# EAGLE design MainModule (EAGLE 6.6.0)

## Sheet 1 of 2
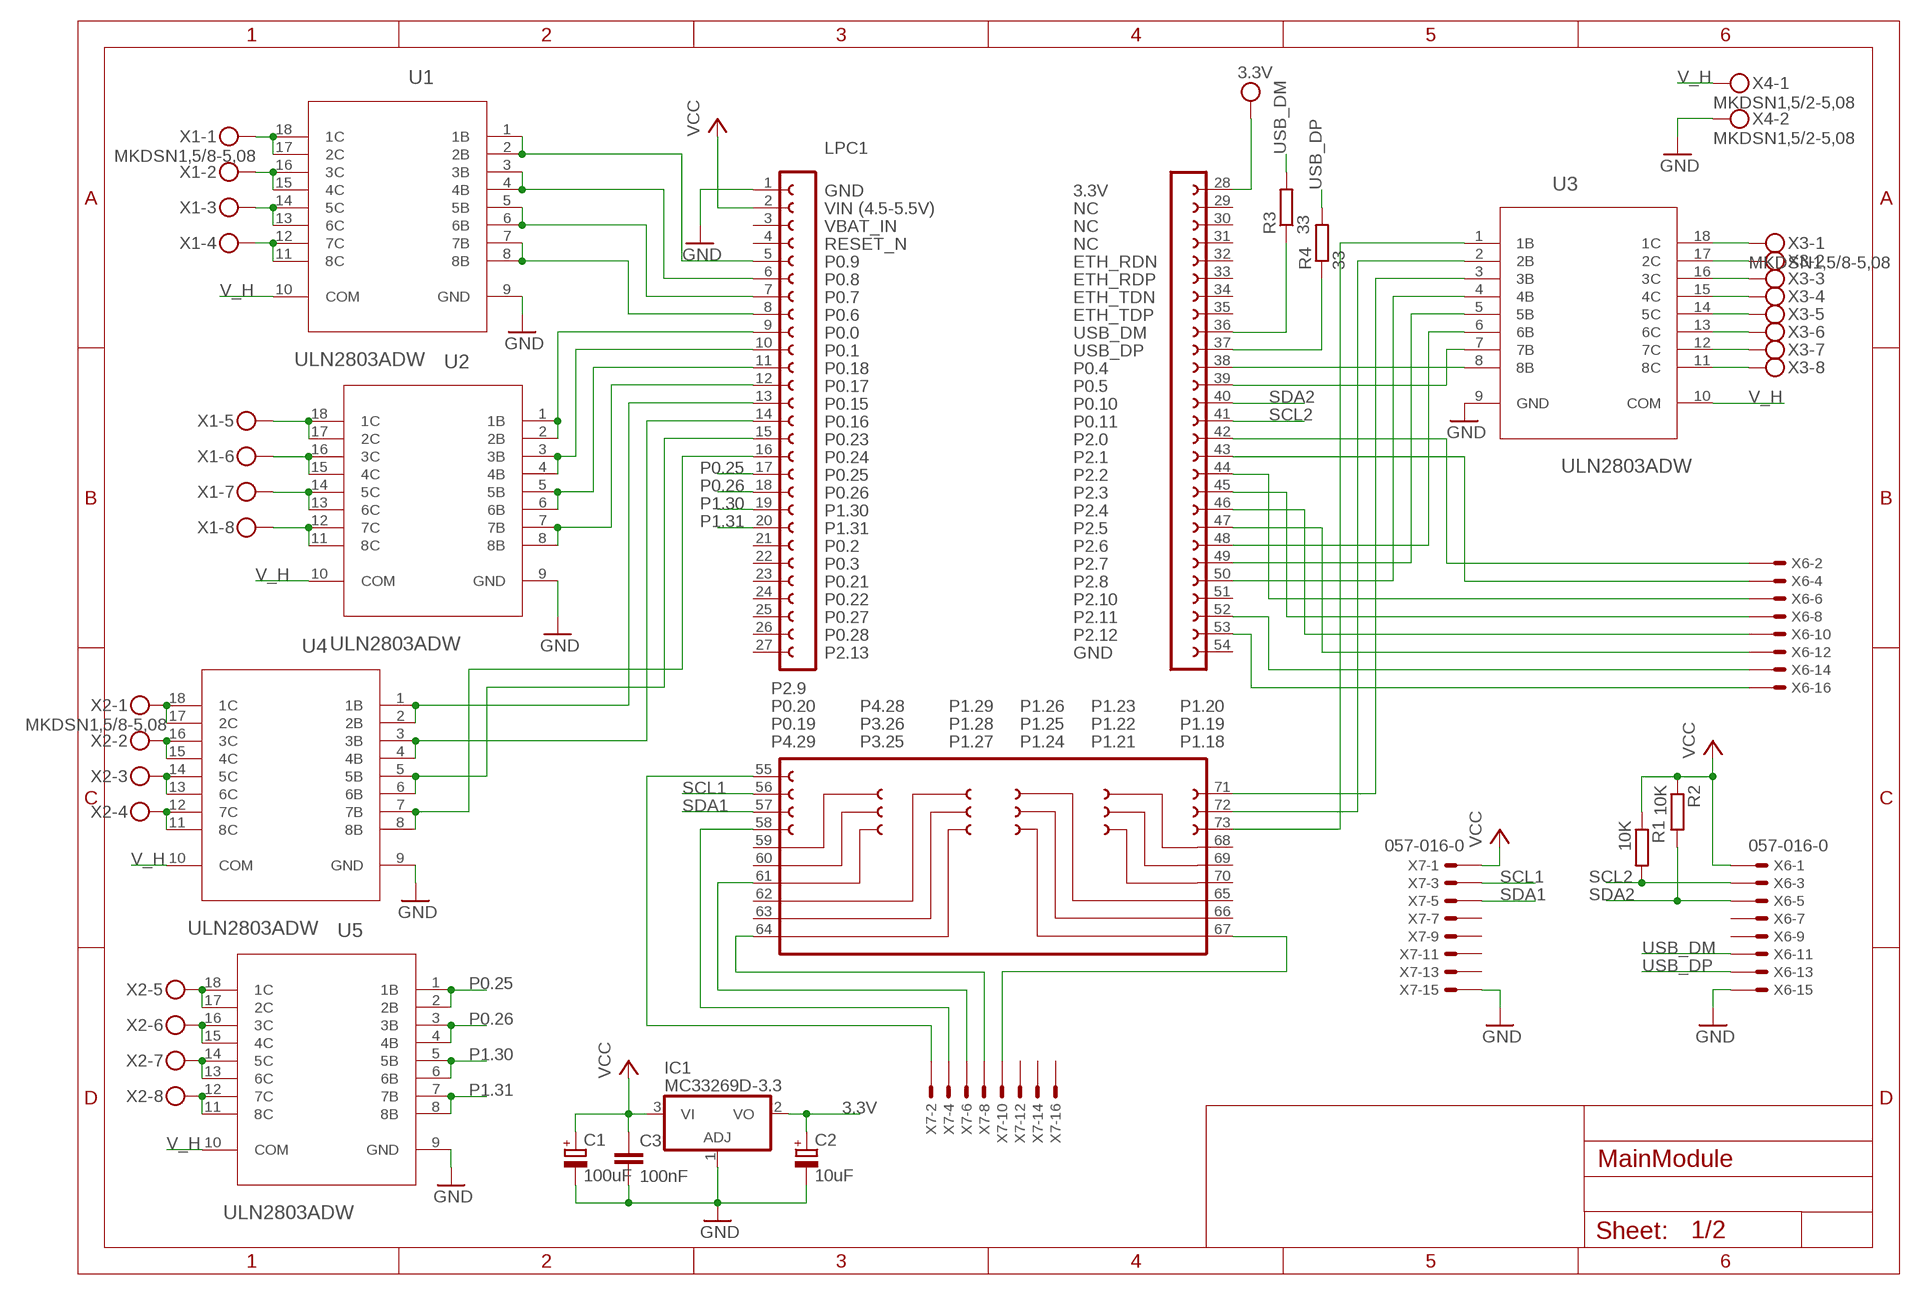
[diagram p0: schematic, sheet 1]

### Parts
C1  100uF  CPOL-EU153CLV-0810  [153CLV-0810]
C2  10uF  CPOL-EU153CLV-0810  [153CLV-0810]
C3  100nF  C-EUC0805  [C0805]
IC1  MC33269D-3.3  [DPACK]
LPC1  LPCXPRESSO_LPC1769  [LPCXPRESSO_LPC1769]
R1  10K  R-EU_MELF0204W  [MINI_MELF-0204W]
R2  10K  R-EU_MELF0204W  [MINI_MELF-0204W]
R3  33  R-EU_M3216  [M3216]
R4  33  R-EU_M3216  [M3216]
U1  ULN2803ADW  [SOIC127P1030X265-18N]
U2  ULN2803ADW  [SOIC127P1030X265-18N]
U3  ULN2803ADW  [SOIC127P1030X265-18N]
U4  ULN2803ADW  [SOIC127P1030X265-18N]
U5  ULN2803ADW  [SOIC127P1030X265-18N]
X1  MKDSN1,5/8-5,08  [MKDSN1,5/8-5,08]
X2  MKDSN1,5/8-5,08  [MKDSN1,5/8-5,08]
X3  MKDSN1,5/8-5,08  [MKDSN1,5/8-5,08]
X4  MKDSN1,5/2-5,08  [MKDSN1,5/2-5,08]
X6  057-016-0  [057-016-0]
X7  057-016-0  [057-016-0]

### Nets
3.3V: C2.+ IC1.2(VO) LPC1.28
GND: C1.- C2.- C3.2 IC1.1(ADJ) LPC1.1 U1.9(GND) U2.9(GND) U3.9(GND) U4.9(GND) U5.9(GND) X4.2 X6.15 X7.15 ; also sheet 2
N$13: U5.17(2C) U5.18(1C) X2.5
N$14: U5.15(4C) U5.16(3C) X2.6
N$15: U2.17(2C) U2.18(1C) X1.5
N$16: U5.13(6C) U5.14(5C) X2.7
N$17: LPC1.38 U3.8(8B)
N$18: LPC1.39 U3.7(7B)
N$19: LPC1.48 U3.6(6B)
N$20: LPC1.49 U3.5(5B)
N$21: LPC1.50 U3.4(4B)
N$22: U1.15(4C) U1.16(3C) X1.2
N$23: U1.13(6C) U1.14(5C) X1.3
N$24: LPC1.73 U3.1(1B)
N$25: U1.17(2C) U1.18(1C) X1.1
N$26: U1.11(8C) U1.12(7C) X1.4
N$27: U5.11(8C) U5.12(7C) X2.8
N$28: U2.15(4C) U2.16(3C) X1.6
N$29: U2.13(6C) U2.14(5C) X1.7
N$30: U2.11(8C) U2.12(7C) X1.8
N$31: U4.17(2C) U4.18(1C) X2.1
N$32: U4.15(4C) U4.16(3C) X2.2
N$33: U4.13(6C) U4.14(5C) X2.3
N$34: U4.11(8C) U4.12(7C) X2.4
N$41: U3.18(1C) X3.1
N$42: U3.17(2C) X3.2
N$43: U3.16(3C) X3.3
N$44: U3.15(4C) X3.4
N$45: U3.14(5C) X3.5
N$46: U3.13(6C) X3.6
N$47: U3.12(7C) X3.7
N$48: U3.11(8C) X3.8
N$49: LPC1.42 X6.2
N$50: LPC1.47 X6.12
N$51: LPC1.46 X6.10
N$52: LPC1.45 X6.8
N$53: LPC1.44 X6.6
N$54: LPC1.53 X6.16
N$55: LPC1.52 X6.14
N$56: LPC1.43 X6.4
N$57: LPC1.67 X7.10
N$60: LPC1.64 X7.8
N$62: LPC1.61 X7.6
N$63: LPC1.58 X7.4
N$64: LPC1.55 X7.2
N$65: LPC1.36 R3.1
N$66: LPC1.37 R4.1
N$68: LPC1.72 U3.2(2B)
N$69: LPC1.71 U3.3(3B)
OUT1: LPC1.5 U1.1(1B) U1.2(2B) ; also sheet 2
OUT2: LPC1.6 U1.3(3B) U1.4(4B) ; also sheet 2
OUT3: LPC1.7 U1.5(5B) U1.6(6B) ; also sheet 2
OUT4: LPC1.8 U1.7(7B) U1.8(8B) ; also sheet 2
OUT5: LPC1.9 U2.1(1B) U2.2(2B) ; also sheet 2
OUT6: LPC1.10 U2.3(3B) U2.4(4B) ; also sheet 2
OUT7: LPC1.11 U2.5(5B) U2.6(6B) ; also sheet 2
OUT8: LPC1.12 U2.7(7B) U2.8(8B) ; also sheet 2
OUT9: LPC1.13 U4.1(1B) U4.2(2B) ; also sheet 2
OUT10: LPC1.14 U4.3(3B) U4.4(4B) ; also sheet 2
OUT11: LPC1.15 U4.5(5B) U4.6(6B) ; also sheet 2
OUT12: LPC1.16 U4.7(7B) U4.8(8B) ; also sheet 2
P0.25: LPC1.17 U5.1(1B) U5.2(2B) ; also sheet 2
P0.26: LPC1.18 U5.3(3B) U5.4(4B) ; also sheet 2
P1.30: LPC1.19 U5.5(5B) U5.6(6B) ; also sheet 2
P1.31: LPC1.20 U5.7(7B) U5.8(8B) ; also sheet 2
SCL1: LPC1.56 X7.3
SCL2: LPC1.41 R1.2 X6.3
SDA1: LPC1.57 X7.5
SDA2: LPC1.40 R2.2 X6.5
USB_DM: R3.2 X6.11
USB_DP: R4.2 X6.13
V_H: U1.10(COM) U2.10(COM) U3.10(COM) U4.10(COM) U5.10(COM) X4.1
VCC: C1.+ C3.1 IC1.3(VI) LPC1.2 R1.1 R2.1 X6.1 X7.1
Unconnected: LPC1.3 LPC1.4 LPC1.21 LPC1.22 LPC1.23 LPC1.24 LPC1.25 LPC1.26 LPC1.27 LPC1.29 LPC1.30 LPC1.31 LPC1.32 LPC1.33 LPC1.34 LPC1.35 LPC1.51 LPC1.54 LPC1.59 LPC1.60 LPC1.62 LPC1.63 LPC1.65 LPC1.66 LPC1.68 LPC1.69 LPC1.70 X6.7 X6.9 X7.7 X7.9 X7.11 X7.12 X7.13 X7.14 X7.16

## Sheet 2 of 2
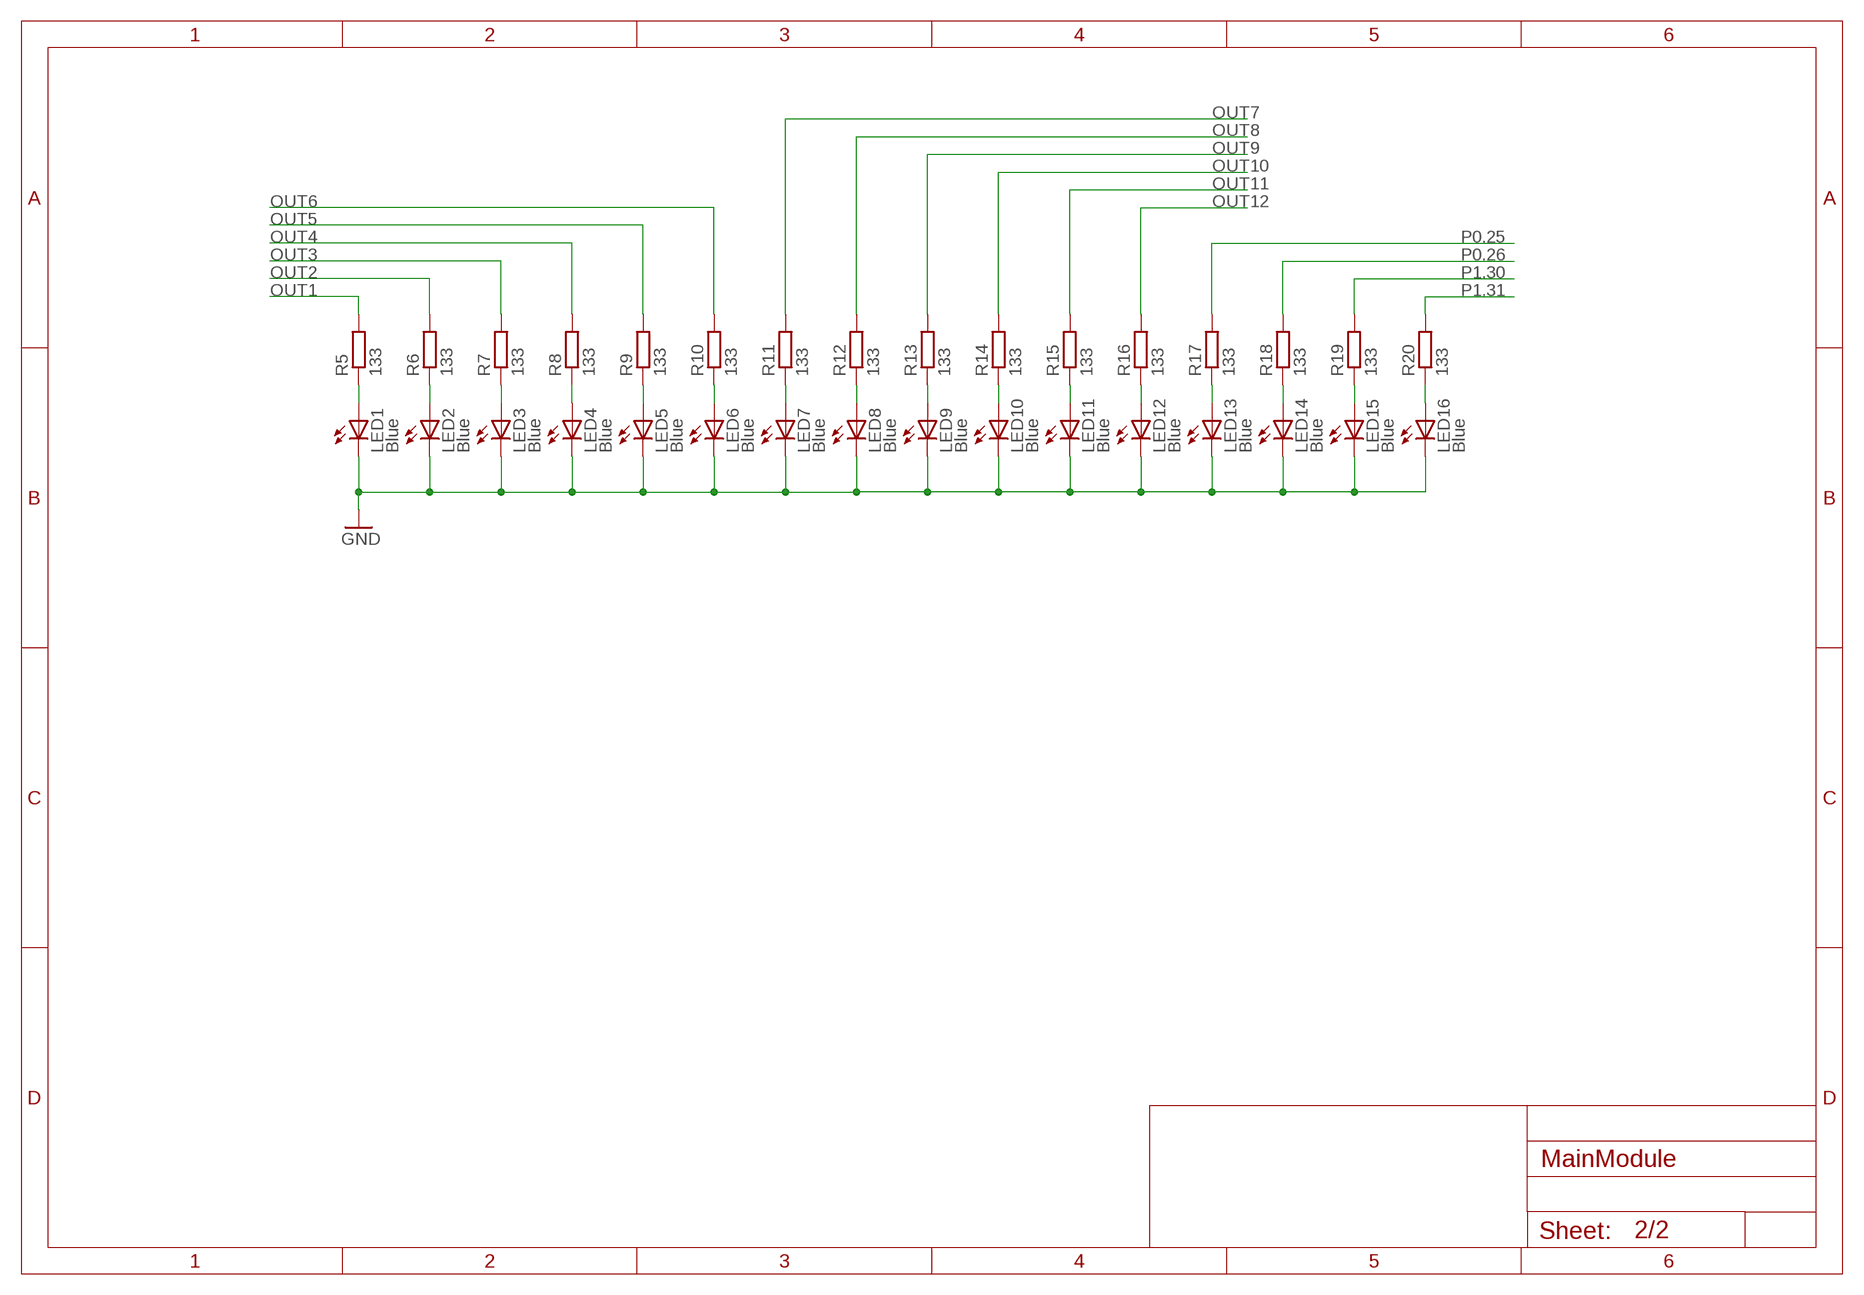
[diagram p1: schematic, sheet 2]

### Parts
LED1  Blue  LEDCHIPLED_0805  [CHIPLED_0805]
LED2  Blue  LEDCHIPLED_0805  [CHIPLED_0805]
LED3  Blue  LEDCHIPLED_0805  [CHIPLED_0805]
LED4  Blue  LEDCHIPLED_0805  [CHIPLED_0805]
LED5  Blue  LEDCHIPLED_0805  [CHIPLED_0805]
LED6  Blue  LEDCHIPLED_0805  [CHIPLED_0805]
LED7  Blue  LEDCHIPLED_0805  [CHIPLED_0805]
LED8  Blue  LEDCHIPLED_0805  [CHIPLED_0805]
LED9  Blue  LEDCHIPLED_0805  [CHIPLED_0805]
LED10  Blue  LEDCHIPLED_0805  [CHIPLED_0805]
LED11  Blue  LEDCHIPLED_0805  [CHIPLED_0805]
LED12  Blue  LEDCHIPLED_0805  [CHIPLED_0805]
LED13  Blue  LEDCHIPLED_0805  [CHIPLED_0805]
LED14  Blue  LEDCHIPLED_0805  [CHIPLED_0805]
LED15  Blue  LEDCHIPLED_0805  [CHIPLED_0805]
LED16  Blue  LEDCHIPLED_0805  [CHIPLED_0805]
R5  133  R-EU_R1206W  [R1206W]
R6  133  R-EU_R1206W  [R1206W]
R7  133  R-EU_R1206W  [R1206W]
R8  133  R-EU_R1206W  [R1206W]
R9  133  R-EU_R1206W  [R1206W]
R10  133  R-EU_R1206W  [R1206W]
R11  133  R-EU_R1206W  [R1206W]
R12  133  R-EU_R1206W  [R1206W]
R13  133  R-EU_R1206W  [R1206W]
R14  133  R-EU_R1206W  [R1206W]
R15  133  R-EU_R1206W  [R1206W]
R16  133  R-EU_R1206W  [R1206W]
R17  133  R-EU_R1206W  [R1206W]
R18  133  R-EU_R1206W  [R1206W]
R19  133  R-EU_R1206W  [R1206W]
R20  133  R-EU_R1206W  [R1206W]

### Nets
GND: LED1.C LED2.C LED3.C LED4.C LED5.C LED6.C LED7.C LED8.C LED9.C LED10.C LED11.C LED12.C LED13.C LED14.C LED15.C LED16.C ; also sheet 1
N$1: LED15.A R19.1
N$2: LED13.A R17.1
N$3: LED14.A R18.1
N$4: LED16.A R20.1
N$35: LED1.A R5.1
N$36: LED2.A R6.1
N$37: LED3.A R7.1
N$38: LED4.A R8.1
N$39: LED5.A R9.1
N$40: LED6.A R10.1
N$58: LED7.A R11.1
N$59: LED8.A R12.1
N$61: LED9.A R13.1
N$67: LED10.A R14.1
N$70: LED11.A R15.1
N$71: LED12.A R16.1
OUT1: R5.2 ; also sheet 1
OUT2: R6.2 ; also sheet 1
OUT3: R7.2 ; also sheet 1
OUT4: R8.2 ; also sheet 1
OUT5: R9.2 ; also sheet 1
OUT6: R10.2 ; also sheet 1
OUT7: R11.2 ; also sheet 1
OUT8: R12.2 ; also sheet 1
OUT9: R13.2 ; also sheet 1
OUT10: R14.2 ; also sheet 1
OUT11: R15.2 ; also sheet 1
OUT12: R16.2 ; also sheet 1
P0.25: R17.2 ; also sheet 1
P0.26: R18.2 ; also sheet 1
P1.30: R19.2 ; also sheet 1
P1.31: R20.2 ; also sheet 1

## Library data of the parts
C1 C2 = rcl:CPOL-EU: POLARIZED CAPACITOR, European symbol
C3 = rcl:C-EU: CAPACITOR, European symbol
IC1 = linear:MC33269?*: Adjustable Output Low Dropout Voltage Regulator 800 mA Source: http://www.onsemi.com/pub/Collateral/MC33269-D.PDF
LED1-LED16 = led:LED: LED OSRAM: - CHIPLED LG R971, LG N971, LY N971, LG Q971, LY Q971, LO R971, LY R971 LH N974, LH R974 LS Q976, LO Q976, LY Q976 LO Q996 - Hyper CHIPLED LW Q18S LB Q993, LB Q99A, LB R99A - SideLED LS A670, LO A670, LY A670, LG A670, LP A670 LB A673, LV A673, LT A673, LW A673 LH A674 LY A675 LS A676, LA A676, LO A676, LY A676, LW A676 LS A679, LY A679, LG A679 - Hyper Micro SIDELED® LS Y876, LA Y876, LO Y876, LY Y876 LT Y87S - SmartLED LW L88C, LW L88S LB L89C, LB L89S, LG L890 LS L89K, LO L89K, LY L89K LS L896, LA L896, LO L896, LY L896 - TOPLED LS T670, LO T670, LY T670, LG T670, LP T670 LSG T670, LSP T670, LSY T670, LOP T670, LYG T670 LG T671, LOG T671, LSG T671 LB T673, LV T673, LT T673, LW T673 LH T674 LS T676, LA T676, LO T676, LY T676, LB T676, LH T676, LSB T676, LW T676 LB T67C, LV T67C, LT T67C, LS T67K, LO T67K, LY T67K, LW E67C LS E67B, LA E67B, LO E67B, LY E67B, LB E67C, LV E67C, LT E67C LW T67C LS T679, LY T679, LG T679 LS T770, LO T770, LY T770, LG T770, LP T770 LB T773, LV T773, LT T773, LW T773 LH T774 LS E675, LA E675, LY E675, LS T675 LS T776, LA T776, LO T776, LY T776, LB T776 LHGB T686 LT T68C, LB T68C - Hyper Mini TOPLED® LB M676 - Mini TOPLED Santana® LG M470 LS M47K, LO M47K, LY M47K Source: http://www.osram.convergy.de LUXEON: - LUMILED® LXK2-PW12-R00, LXK2-PW12-S00, LXK2-PW14-U00, LXK2-PW14-V00 LXK2-PM12-R00, LXK2-PM12-S00, LXK2-PM14-U00 LXK2-PE12-Q00, LXK2-PE12-R00, LXK2-PE12-S00, LXK2-PE14-T00, LXK2-PE14-U00 LXK2-PB12-K00, LXK2-PB12-L00, LXK2-PB12-M00, LXK2-PB14-N00, LXK2-PB14-P00, LXK2-PB14-Q00 LXK2-PR12-L00, LXK2-PR12-M00, LXK2-PR14-Q00, LXK2-PR14-R00 LXK2-PD12-Q00, LXK2-PD12-R00, LXK2-PD12-S00 LXK2-PH12-R00, LXK2-PH12-S00 LXK2-PL12-P00, LXK2-PL12-Q00, LXK2-PL12-R00 Source: www.luxeon.com KINGBRIGHT: KA-3528ASYC Source: www.kingbright.com
LPC1 = LPCXpresso_LPC1769:LPCXPRESSO_LPC1769
R1 R2 R5-R20 = rcl:R-EU_: RESISTOR, European symbol
R3 R4 = resistor:R-EU_: RESISTOR, European symbol
U1-U5 = ULN2803:ULN2803ADW: Darlington transistor array; MPN: ULN2803ADW; OC_FARNELL: 1652419; OC_NEWARK: 69K0711; PACKAGE: SOIC-18; SUPPLIER: TEXAS INSTRUMENTS
X1-X3 = con-phoenix-508:MKDSN1,5/8-5,08: MKDSN 1,5/ 8-5,08 Printklemme Nennstrom: 13,5 A Nennspannung: 250 V Rastermaß: 5,08 mm Polzahl: 8 Anschlussart: Schraubanschluss Montage: Löten Anschlussrichtung Leiter/Platine: 0 ° Artikelnummer: 1729186 Source: http://eshop.phoenixcontact.com .. 1729186.pdf
X4 = con-phoenix-508:MKDSN1,5/2-5,08: MKDSN 1,5/ 2-5,08 Printklemme Nennstrom: 13,5 A Nennspannung: 250 V Rastermaß: 5,08 mm Polzahl: 2 Anschlussart: Schraubanschluss Montage: Löten Anschlussrichtung Leiter/Platine: 0 ° Artikelnummer: 1729128 Source: http://eshop.phoenixcontact.com .. 1729128.pdf
X6 X7 = con-panduit:057-016-: CONNECTOR 10-pin series 057 contact pc board low profile headers; OC_FARNELL: unknown; OC_NEWARK: unknown

## Board
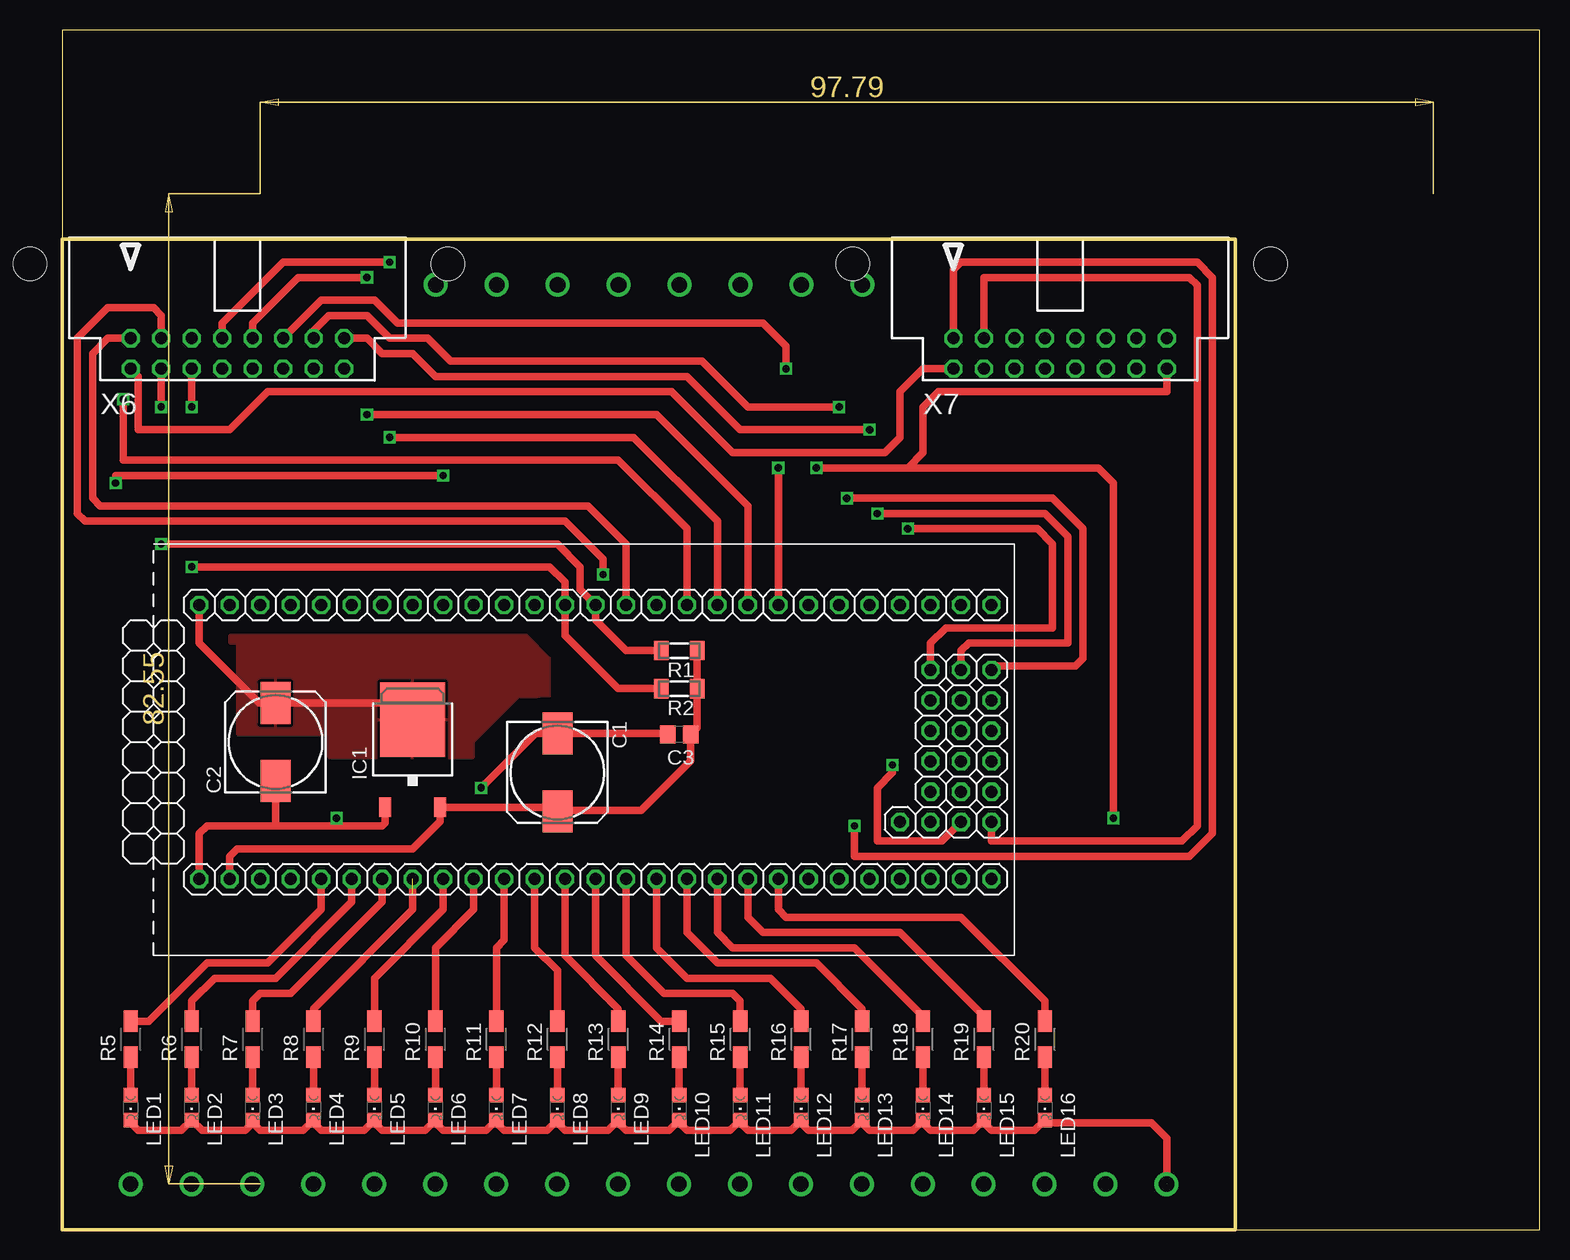
[diagram p2: board, top side]
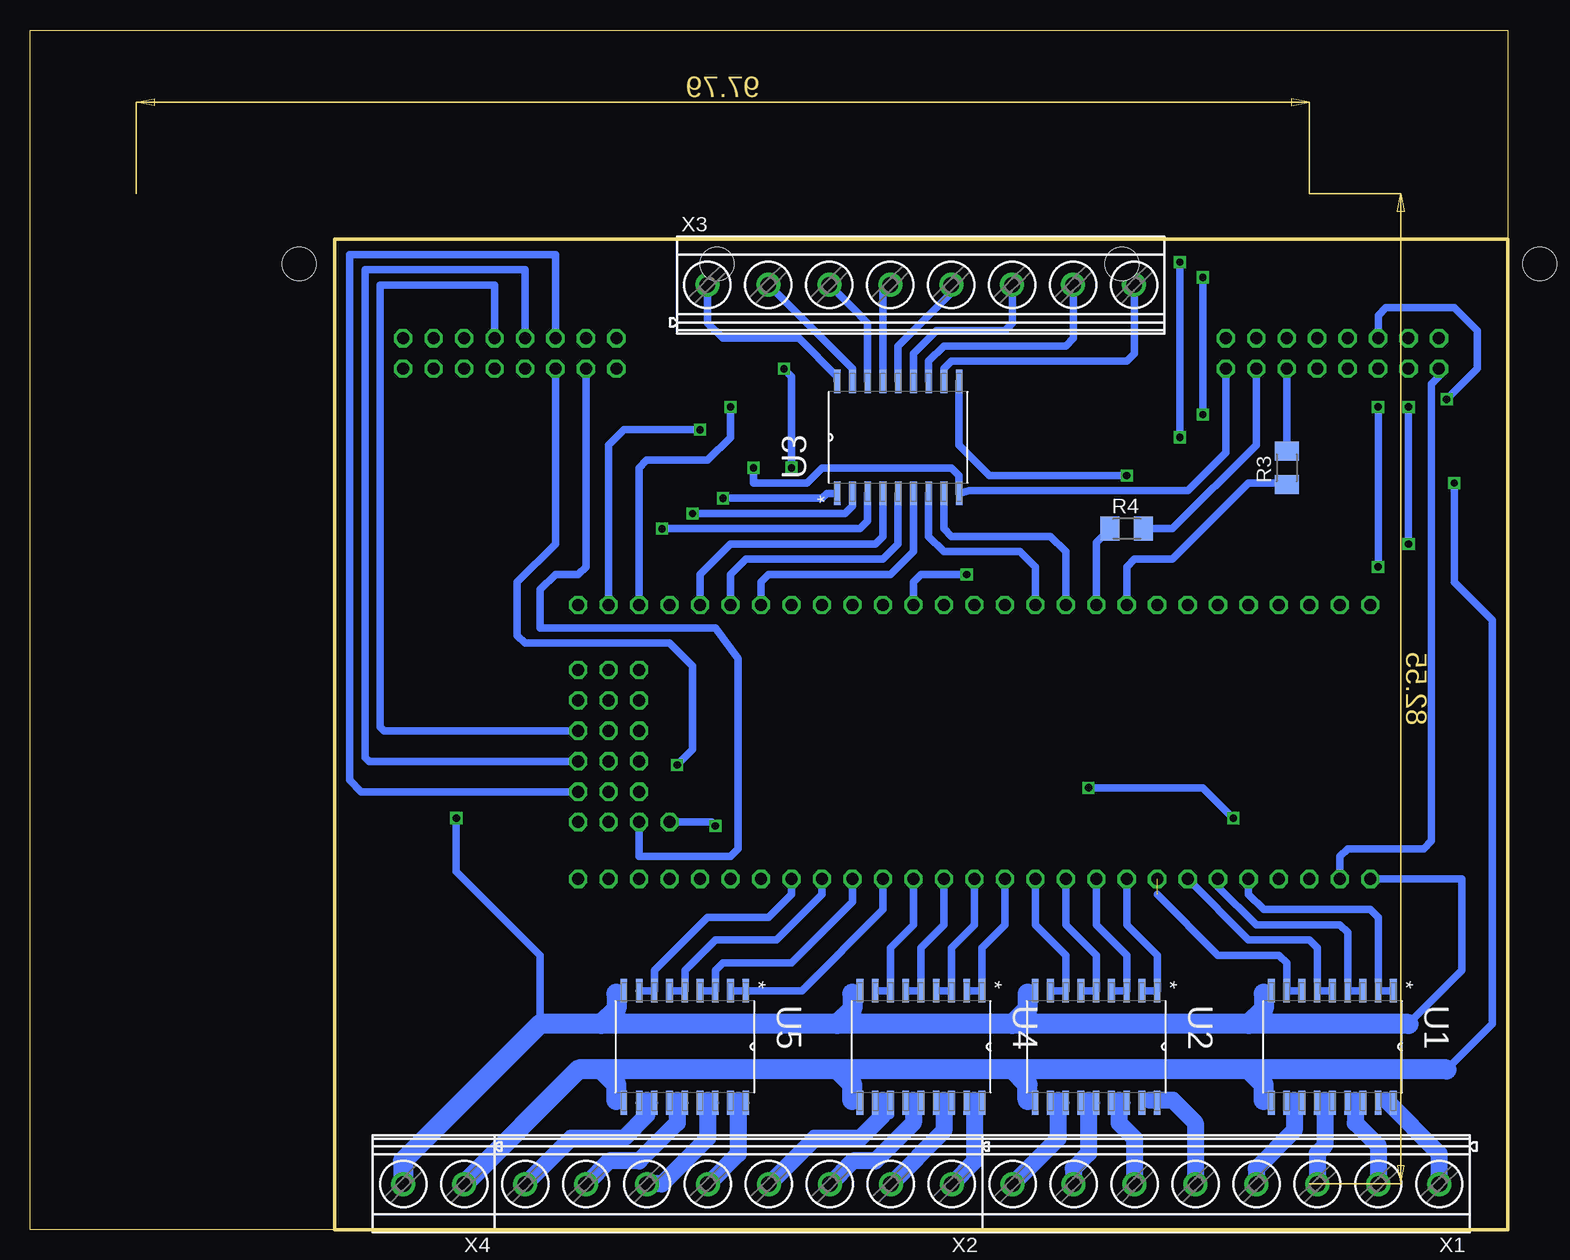
[diagram p3: board, bottom side, seen from below]

Size 123.17 x 100 mm. Coordinates in mm from the lower left corner, seen from the top.
Outline: 0,0 123.17,0 123.17,100 0,100 0,0
Copper layers (1*16): Top 0.035mm / dielectric 1.5mm / Bottom 0.035mm
Design rules "default": minimum track width 10mil, minimum drill 24mil, track to track 8mil, track to pad 8mil, pad to pad 8mil, via to via 8mil, smd to smd 8mil, copper to edge 40mil, drill to drill 8mil, minimum pad ring 10mil, minimum via ring 8mil, stop-mask expansion 4mil, vias tented up to drill 0mil, thermal gap 10mil
Milling: 4 lines

### Footprints (pad centres in the part's own frame; a part is rotated, then mirrored left to right if it is on the bottom)
153CLV-0810 = smd 3.5 x 2.5: + 3.25,0; - -3.25,0
C0805 = smd 1.3 x 1.5: 1 -0.95,0; 2 0.95,0
DPACK = smd 1 x 1.6: 1 -2.28,-4.8; 3 2.28,-4.8 | smd 5.4 x 6.2: 2 0,2.5
CHIPLED_0805 = smd 1.2 x 1.2: A 0,-1.05; C 0,1.05
LPCXPRESSO_LPC1769 = drill 1 octagon: 1 -20.955,-10.795; 2 -18.415,-10.795; 3 -15.875,-10.795; 4 -13.335,-10.795; 5 -10.795,-10.795; 6 -8.255,-10.795; 7 -5.715,-10.795; 8 -3.175,-10.795; 9 -0.635,-10.795; 10 1.905,-10.795; 11 4.445,-10.795; 12 6.985,-10.795; 13 9.525,-10.795; 14 12.065,-10.795; 15 14.605,-10.795; 16 17.145,-10.795; 17 19.685,-10.795; 18 22.225,-10.795; 19 24.765,-10.795; 20 27.305,-10.795; 21 29.845,-10.795; 22 32.385,-10.795; 23 34.925,-10.795; 24 37.465,-10.795; 25 40.005,-10.795; 26 42.545,-10.795; 27 45.085,-10.795; 28 -20.955,12.065; 29 -18.415,12.065; 30 -15.875,12.065; 31 -13.335,12.065; 32 -10.795,12.065; 33 -8.255,12.065; 34 -5.715,12.065; 35 -3.175,12.065; 36 -0.635,12.065; 37 1.905,12.065; 38 4.445,12.065; 39 6.985,12.065; 40 9.525,12.065; 41 12.065,12.065; 42 14.605,12.065; 43 17.145,12.065; 44 19.685,12.065; 45 22.225,12.065; 46 24.765,12.065; 47 27.305,12.065; 48 29.845,12.065; 49 32.385,12.065; 50 34.925,12.065; 51 37.465,12.065; 52 40.005,12.065; 53 42.545,12.065; 54 45.085,12.065; 55 37.465,-6.045; 56 40.005,-6.045; 57 42.545,-6.045; 58 45.085,-6.045; 59 40.005,-3.505; 60 42.545,-3.505; 61 45.085,-3.505; 62 40.005,-0.965; 63 42.545,-0.965; 64 45.085,-0.965; 65 40.005,1.575; 66 42.545,1.575; 67 45.085,1.575; 68 40.005,4.115; 69 42.545,4.115; 70 45.085,4.115; 71 40.005,6.655; 72 42.545,6.655; 73 45.085,6.655
MINI_MELF-0204W = smd 1.2 x 1.6: 1 -1.5,0; 2 1.5,0
M3216 = smd 1.6 x 2: 1 -1.4,0; 2 1.4,0
R1206W = smd 1.8 x 1.2: 1 -1.499,0; 2 1.499,0
SOIC127P1030X265-18N = smd 1.981 x 0.559: 1 -4.674,5.08; 2 -4.674,3.81; 3 -4.674,2.54; 4 -4.674,1.27; 5 -4.674,0; 6 -4.674,-1.27; 7 -4.674,-2.54; 8 -4.674,-3.81; 9 -4.674,-5.08; 10 4.674,-5.08; 11 4.674,-3.81; 12 4.674,-2.54; 13 4.674,-1.27; 14 4.674,0; 15 4.674,1.27; 16 4.674,2.54; 17 4.674,3.81; 18 4.674,5.08
MKDSN1,5/8-5,08 = drill 1.3 pad 2: 1 -17.801,0.025; 2 -12.721,0.025; 3 -7.641,0.025; 4 -2.561,0.025; 5 2.519,0.025; 6 7.599,0.025; 7 12.679,0.025; 8 17.759,0.025
MKDSN1,5/2-5,08 = drill 1.3 pad 2: 1 -2.561,0.025; 2 2.519,0.025
057-016-0 = drill 1 octagon: 1 -8.89,-5.08; 2 -8.89,-2.54; 3 -6.35,-5.08; 4 -6.35,-2.54; 5 -3.81,-5.08; 6 -3.81,-2.54; 7 -1.27,-5.08; 8 -1.27,-2.54; 9 1.27,-5.08; 10 1.27,-2.54; 11 3.81,-5.08; 12 3.81,-2.54; 13 6.35,-5.08; 14 6.35,-2.54; 15 8.89,-5.08; 16 8.89,-2.54 | hole 2.8: -17.29,3.66; 17.54,3.66

### Placement (x,y rotation side)
C1  41.27,38.1 270 top
C2  17.78,40.64 90 top
C3  51.44,41.27 180 top
IC1  29.21,40.01 0 top
LED1  5.71,10.16 180 top
LED2  10.79,10.16 180 top
LED3  15.88,10.16 180 top
LED4  20.95,10.16 180 top
LED5  26.04,10.16 180 top
LED6  31.11,10.16 180 top
LED7  36.2,10.16 180 top
LED8  41.27,10.16 180 top
LED9  46.35,10.16 180 top
LED10  51.44,10.16 180 top
LED11  56.52,10.16 180 top
LED12  61.59,10.16 180 top
LED13  66.67,10.16 180 top
LED14  71.75,10.16 180 top
LED15  76.83,10.16 180 top
LED16  81.92,10.16 180 top
LPC1  32.38,40.01 0 top
R1  51.44,48.26 180 top
R2  51.44,45.09 180 top
R3  18.41,63.5 90 bottom
R4  31.75,58.42 0 bottom
R5  5.71,15.88 90 top
R6  10.79,15.88 90 top
R7  15.88,15.88 90 top
R8  20.95,15.88 90 top
R9  26.04,15.88 90 top
R10  31.11,15.88 90 top
R11  36.2,15.88 90 top
R12  41.27,15.88 90 top
R13  46.35,15.88 90 top
R14  51.44,15.88 90 top
R15  56.52,15.88 90 top
R16  61.59,15.88 90 top
R17  66.67,15.88 90 top
R18  71.75,15.88 90 top
R19  76.83,15.88 90 top
R20  81.92,15.88 90 top
U1  14.61,15.24 270 bottom
U2  34.29,15.24 270 bottom
U3  50.8,66.04 90 bottom
U4  48.9,15.24 270 bottom
U5  68.58,15.24 270 bottom
X1  23.5,3.81 180 bottom
X2  64.14,3.81 180 bottom
X3  48.9,78.74 0 bottom
X4  89.53,3.81 180 bottom
X6  14.61,76.83 0 top
X7  83.19,76.83 0 top

### Tracks (layer width: path | path; a pad name or v marks a point on that pad's centre or on a via)
3.3V
  Top 0.61: LPC1.28 11.43,48.9 16.43,43.89 C2.+ 27.82,43.89 IC1.2
  pour Top (isolate 1.27, rank 5): 13.97,48.9 14.61,48.9 14.61,41.27 22.23,41.27 22.23,39.37 34.29,39.37 34.29,40.64 38.1,44.45 40.64,44.45 40.64,47.62 38.73,49.53 13.97,49.53
GND  (via drill 0.6)  (1 unrouted)
  Top 0.61: X7.15 92.08,69.85 73.03,69.85 71.75,68.58 71.75,64.77 70.48,63.5 | v62.87,63.5 70.48,63.5 | 70.48,63.5 86.36,63.5 87.63,62.23 v87.63,34.29 | C3.2 50.41,41.35 C1.- 39.45,41.35 v34.92,36.83 | IC1.1 26.93,33.91 26.67,33.66 22.86,33.66 | 22.86,33.66 17.78,33.66 | 17.78,33.66 12.06,33.66 11.43,33.02 LPC1.1 | C2.- 17.78,33.66 | v22.86,34.29 22.86,33.66 | LED1.C 5.71,8.89 6.35,8.26 9.94,8.26 LED2.C 11.65,8.26 15.24,8.26 15.88,8.89 | LED3.C 15.88,8.89 | 15.88,8.89 16.51,8.26 20.1,8.26 LED4.C 20.95,8.89 21.59,8.26 25.18,8.26 LED5.C 26.04,8.89 26.67,8.26 30.26,8.26 LED6.C 31.11,8.89 31.75,8.26 35.34,8.26 LED7.C 36.2,8.89 36.83,8.26 40.42,8.26 LED8.C 41.27,8.89 41.91,8.26 45.5,8.26 LED9.C 46.35,8.89 46.99,8.26 50.58,8.26 LED10.C 51.44,8.89 52.07,8.26 55.66,8.26 LED11.C 56.52,8.89 57.15,8.26 60.74,8.26 LED12.C 61.59,8.89 62.23,8.26 65.82,8.26 LED13.C 66.67,8.89 67.31,8.26 70.9,8.26 LED14.C 71.75,8.89 72.39,8.26 75.98,8.26 LED15.C 76.83,8.89 77.47,8.26 81.06,8.26 LED16.C 82.14,8.89 90.81,8.89 92.08,7.62 92.08,3.81
  Bottom 0.254: U1.9 20.09,19.91 20.32,19.68 | U2.9 39.78,19.91 40.01,19.68 | U4.9 54.38,19.91 54.61,19.68 | U5.9 74.07,19.91 74.3,19.68
  Bottom 0.61: X6.15 23.5,64.77 26.67,61.59 44.86,61.59 U3.9 45.72,62.87 46.35,63.5 57.15,63.5 58.42,62.23 62.87,62.23 v62.87,63.5 | v87.63,34.29 87.63,29.84 80.64,22.86 80.64,17.14 | LPC1.1 3.81,29.21 3.81,21.59 8.26,17.14 | v34.92,36.83 25.4,36.83 v22.86,34.29
  Bottom 1.676: 8.26,17.14 21.59,17.14 | 21.59,17.14 41.27,17.14 | 41.27,17.14 55.88,17.14 | 55.88,17.14 75.56,17.14 | 75.56,17.14 80.64,17.14 92.08,5.71 92.08,3.81 X4.2 | 20.32,19.68 20.32,18.41 21.59,17.14 | 40.01,19.68 40.01,18.41 41.27,17.14 | 54.61,19.68 54.61,18.41 55.88,17.14 | 74.3,19.68 74.3,18.41 75.56,17.14
N$1
  Top 0.61: LED15.A R19.1
N$2
  Top 0.61: LED13.A R17.1
N$3
  Top 0.61: LED14.A R18.1
N$4
  Top 0.61: LED16.A R20.1
N$13
  Bottom 0.254: U5.17 64.36,10.57 64.14,10.79
  Bottom 0.61: U5.17 U5.18
  Bottom 1.422: 64.14,10.79 64.14,6.3 X2.5
N$14
  Bottom 0.254: U5.15 66.9,10.57 66.67,10.79
  Bottom 0.61: U5.16 U5.15
  Bottom 1.422: 66.67,10.79 66.67,7.62 70.48,3.81 71.71,3.81 X2.6
N$15
  Bottom 0.254: 28.98,10.57 29.62,10.57 29.84,10.79
  Bottom 0.61: U2.17 U2.18 28.98,10.57
  Bottom 1.422: 29.84,10.79 27.94,10.79 26.04,8.89 26.04,3.81 X1.5
N$16
  Bottom 0.254: U5.13 69.44,10.57 69.22,10.79
  Bottom 0.61: U5.14 U5.13
  Bottom 1.422: 69.22,10.79 69.22,8.89 72.39,5.71 74.88,5.71 X2.7
N$17
  Bottom 0.61: U3.8 46.99,58.42 46.35,57.78 38.1,57.78 36.83,56.52 LPC1.38
N$18
  Bottom 0.61: U3.7 48.26,57.78 46.99,56.52 40.64,56.52 39.37,55.24 LPC1.39
N$19
  Bottom 0.61: U3.6 49.53,56.52 51.44,54.61 61.59,54.61 62.23,53.98 LPC1.48
N$20
  Bottom 0.61: U3.5 50.8,57.15 52.07,55.88 63.5,55.88 64.77,54.61 LPC1.49
N$21
  Bottom 0.61: U3.4 52.07,57.78 52.7,57.15 64.77,57.15 67.31,54.61 LPC1.50
N$22
  Bottom 0.254: U1.16 12.47,10.57 12.7,10.79
  Bottom 0.61: U1.16 U1.15
  Bottom 1.422: 12.7,10.79 12.7,8.89 10.79,6.99 10.79,3.81 X1.2
N$23
  Bottom 0.254: U1.14 15.01,10.57 15.24,10.79
  Bottom 0.61: U1.14 U1.13
  Bottom 1.422: 15.24,10.79 15.24,6.99 15.88,6.35 15.88,3.81 X1.3
N$24  (via drill 0.6)
  Top 0.61: v65.41,60.96 82.55,60.96 85.09,58.42 85.09,47.62 84.45,46.99 77.8,46.99 LPC1.73
  Bottom 0.61: U3.1 56.74,61.37 57.15,60.96 v65.41,60.96
N$25
  Bottom 0.254: U1.18 9.93,10.57 10.16,10.79
  Bottom 0.61: U1.18 U1.17
  Bottom 1.422: 10.16,10.79 5.71,6.35 5.71,3.81 X1.1
N$26
  Bottom 0.254: U1.12 17.55,10.57 17.78,10.79
  Bottom 0.61: U1.12 U1.11
  Bottom 1.422: 17.78,10.79 17.78,8.26 20.95,5.08 20.95,3.81 X1.4
N$27
  Bottom 0.254: U5.11 71.98,10.57 71.75,10.79
  Bottom 0.61: U5.12 U5.11
  Bottom 1.422: 71.75,10.79 71.75,9.53 73.66,7.62 78.06,7.62 X2.8
N$28
  Bottom 0.254: U2.16 32.16,10.57 32.38,10.79
  Bottom 0.61: U2.15 U2.16
  Bottom 1.422: 32.38,10.79 32.38,8.89 31.11,7.62 31.11,3.81 X1.6
N$29
  Bottom 0.254: U2.14 34.7,10.57 34.92,10.79
  Bottom 0.61: U2.13 U2.14
  Bottom 1.422: 34.92,10.79 34.92,6.35 36.2,5.08 36.2,3.81 X1.7
N$30
  Bottom 0.254: U2.12 37.24,10.57 37.47,10.79
  Bottom 0.61: U2.11 U2.12
  Bottom 1.422: 37.47,10.79 37.47,7.57 X1.8
N$31
  Bottom 0.254: U4.17 44.68,10.57 44.45,10.79
  Bottom 0.61: U4.18 U4.17
  Bottom 1.422: 44.45,10.79 44.45,5.67 X2.1
N$32
  Bottom 0.254: U4.15 47.22,10.57 46.99,10.79
  Bottom 0.61: U4.16 U4.15
  Bottom 1.422: 46.99,10.79 46.99,8.21 X2.2
N$33
  Bottom 0.254: 50.16,10.16 49.53,10.79
  Bottom 0.61: U4.13 U4.14 49.76,10.57 50.16,10.16
  Bottom 1.422: 49.53,10.79 49.53,8.89 52.7,5.71 54.56,5.71 X2.3
N$34
  Bottom 0.254: 51.44,9.53 51.44,10.16 52.07,10.79
  Bottom 0.61: U4.11 U4.12 51.44,9.53
  Bottom 1.422: 52.07,10.79 52.07,9.53 53.98,7.62 57.74,7.62 X2.4
N$35
  Top 0.61: LED1.A R5.1
N$36
  Top 0.61: LED2.A R6.1
N$37
  Top 0.61: LED3.A R7.1
N$38
  Top 0.61: LED4.A R8.1
N$39
  Top 0.61: R9.1 LED5.A
N$40
  Top 0.61: R10.1 LED6.A
N$41
  Bottom 0.61: U3.18 55.88,71.12 59.05,74.3 65.41,74.3 66.67,75.56 66.67,78.74 X3.1
N$42
  Bottom 0.61: U3.17 54.61,71.75 57.15,74.3 X3.2
N$43
  Bottom 0.61: U3.16 53.34,75.56 54.61,76.83 54.61,76.84 X3.3
N$44
  Bottom 0.61: U3.15 52.07,78.15 X3.4
N$45
  Bottom 0.61: U3.14 50.8,73.66 46.35,78.11 46.35,78.74 X3.5
N$46
  Bottom 0.61: U3.13 49.53,73.03 47.62,74.93 41.91,74.93 41.27,75.56 41.27,78.74 X3.6
N$47
  Bottom 0.61: U3.12 48.26,72.39 46.99,73.66 36.83,73.66 36.2,74.3 36.2,78.74 X3.7
N$48
  Bottom 0.61: U3.11 46.99,71.75 46.35,72.39 31.75,72.39 31.11,73.03 31.11,78.74 X3.8
N$49
  Top 0.61: X6.2 3.81,74.3 2.54,73.03 2.54,60.96 3.17,60.33 43.81,60.33 46.99,57.15 LPC1.42
N$50  (via drill 0.6)
  Top 0.61: X6.12 21.59,77.47 26.04,77.47 27.94,75.56 58.42,75.56 60.33,73.66 v60.33,71.75 | LPC1.47 v59.69,63.5
  Bottom 0.61: v59.69,63.5 59.69,71.12 v60.33,71.75
N$51  (via drill 0.6)
  Top 0.61: X6.10 15.88,75.56 19.68,79.38 v25.4,79.38 | v25.4,67.94 49.53,67.94 57.15,60.33 LPC1.46
  Bottom 0.61: v25.4,79.38 v25.4,67.94
N$52  (via drill 0.6)
  Top 0.61: X6.8 13.34,75.56 18.41,80.64 v27.3,80.64 | v27.3,66.04 47.62,66.04 54.61,59.05 LPC1.45
  Bottom 0.61: v27.3,80.64 v27.3,66.04
N$53  (via drill 0.6)
  Top 0.61: LPC1.44 52.07,58.42 46.35,64.14 5.08,64.14 v5.08,69.22
  Bottom 0.61: v5.08,69.22 2.54,71.75 2.54,74.93 4.45,76.83 10.16,76.83 10.79,76.2 X6.6
N$54  (via drill 0.6)
  Top 0.61: X6.16 25.4,74.3 26.67,73.03 29.21,73.03 31.11,71.12 52.07,71.12 56.52,66.67 v67.31,66.67
  Bottom 0.61: v67.31,66.67 73.66,66.67 74.93,65.41 LPC1.53
N$55  (via drill 0.6)
  Top 0.61: X6.14 20.95,74.93 22.23,76.2 25.4,76.2 27.3,74.3 30.48,74.3 32.38,72.39 53.34,72.39 57.15,68.58 v64.77,68.58
  Bottom 0.61: v64.77,68.58 64.77,66.04 66.67,64.14 71.75,64.14 72.39,63.5 LPC1.52
N$56  (via drill 0.6)
  Top 0.61: X6.4 8.26,76.2 7.62,76.83 3.81,76.83 1.27,74.3 1.27,59.69 1.91,59.05 41.91,59.05 45.09,55.88 v45.09,54.61
  Bottom 0.61: v45.09,54.61 48.9,54.61 49.53,53.98 LPC1.43
N$57
  Bottom 0.61: X7.10 84.45,78.74 93.98,78.74 93.98,41.91 93.65,41.58 LPC1.67
N$58
  Top 0.61: R11.1 LED7.A
N$59
  Top 0.61: LED8.A R12.1
N$60
  Bottom 0.61: LPC1.64 94.92,39.04 95.25,39.37 95.25,80.01 81.92,80.01 X7.8
N$61
  Top 0.61: LED9.A R13.1
N$62
  Bottom 0.61: LPC1.61 95.56,36.5 96.52,37.47 96.52,81.28 79.38,81.28 X7.6
N$63
  Top 0.61: LPC1.58 77.47,32.38 93.34,32.38 94.61,33.66 94.61,78.74 93.98,79.38 76.83,79.38 X7.4
N$64  (via drill 0.6)
  Top 0.61: v66.04,33.66 66.04,31.11 93.98,31.11 95.89,33.02 95.89,79.38 94.61,80.64 74.93,80.64 74.3,80.01 X7.2
  Bottom 0.61: LPC1.55 66.34,33.96 v66.04,33.66
N$65
  Bottom 0.61: LPC1.36 31.75,55.24 31.11,55.88 27.94,55.88 21.59,62.23 18.55,62.23 R3.1
N$66
  Bottom 0.61: LPC1.37 34.29,57.28 R4.1
N$67
  Top 0.61: LED10.A R14.1
N$68  (via drill 0.6)
  Top 0.61: v67.94,59.69 81.92,59.69 83.82,57.78 83.82,48.9 75.56,48.9 74.93,48.26 LPC1.72
  Bottom 0.61: U3.2 54.61,60.33 55.24,59.69 v67.94,59.69
N$69  (via drill 0.6)
  Top 0.61: v70.48,58.42 81.28,58.42 82.55,57.15 82.55,50.16 73.66,50.16 72.39,48.9 LPC1.71
  Bottom 0.61: U3.3 53.34,59.05 53.98,58.42 v70.48,58.42
N$70
  Top 0.61: LED11.A R15.1
N$71
  Top 0.61: LED12.A R16.1
OUT1
  Top 0.61: R5.2 7.21,17.37 12.06,22.23 17.14,22.23 21.59,26.67 LPC1.5
  Bottom 0.61: LPC1.5 21.59,27.94 20.32,26.67 11.43,26.67 10.79,26.04 U1.2 U1.1
OUT2
  Top 0.61: R6.2 10.79,19.05 12.7,20.95 17.78,20.95 24.13,27.3 LPC1.6
  Bottom 0.61: LPC1.6 24.13,28.57 20.95,25.4 13.97,25.4 13.34,24.77 U1.4 U1.3
OUT3
  Top 0.61: R7.2 15.88,19.05 16.51,19.68 19.05,19.68 26.67,27.3 LPC1.7
  Bottom 0.61: LPC1.7 21.59,24.13 16.51,24.13 15.88,23.5 U1.6 U1.5
OUT4  (1 unrouted)
  Top 0.61: R8.2 20.95,18.41 29.21,26.67 LPC1.8
  Bottom 0.61: 29.21,27.94 24.13,22.86 19.05,22.86 18.41,22.23 U1.8 U1.7
OUT5
  Top 0.61: R9.2 26.04,20.95 31.75,26.67 LPC1.9
  Bottom 0.61: LPC1.9 31.75,25.4 29.21,22.86 U2.1 U2.2
OUT6
  Top 0.61: R10.2 31.11,23.5 34.29,26.67 LPC1.10
  Bottom 0.61: LPC1.10 34.29,25.4 31.75,22.86 U2.3 U2.4
OUT7
  Top 0.61: R11.2 36.2,23.5 36.83,24.13 LPC1.11
  Bottom 0.61: LPC1.11 36.83,25.4 34.29,22.86 U2.5 U2.6
OUT8
  Top 0.61: R12.2 41.27,21.59 39.37,23.5 LPC1.12
  Bottom 0.61: LPC1.12 39.37,25.4 36.83,22.86 U2.7 U2.8
OUT9
  Top 0.61: R13.2 46.35,18.41 41.91,22.86 LPC1.13
  Bottom 0.61: U4.2 U4.1 43.81,23.5 41.91,25.4 LPC1.13
OUT10
  Top 0.61: R14.2 49.94,17.37 44.45,22.86 LPC1.14
  Bottom 0.61: U4.4 U4.3 46.35,23.5 44.45,25.4 LPC1.14
OUT11
  Top 0.61: R15.2 56.52,19.05 55.88,19.68 50.16,19.68 46.99,22.86 LPC1.15
  Bottom 0.61: U4.6 U4.5 48.9,23.5 46.99,25.4 LPC1.15
OUT12
  Top 0.61: R16.2 61.59,18.41 59.05,20.95 52.07,20.95 49.53,23.5 LPC1.16
  Bottom 0.61: U4.8 U4.7 51.44,23.5 49.53,25.4 LPC1.16
P0.25
  Top 0.61: R17.2 66.67,18.41 62.87,22.23 54.61,22.23 52.07,24.77 LPC1.17
  Bottom 0.61: U5.2 U5.1 58.83,19.91 52.07,26.67 LPC1.17
P0.26
  Top 0.61: R18.2 71.75,17.78 66.04,23.5 55.88,23.5 54.61,24.77 LPC1.18
  Bottom 0.61: U5.4 U5.3 66.04,21.59 65.41,22.23 59.69,22.23 54.61,27.3 LPC1.18
P1.30
  Top 0.61: R19.2 76.83,17.78 69.85,24.77 58.42,24.77 57.15,26.04 LPC1.19
  Bottom 0.61: U5.6 U5.5 68.58,21.59 66.04,24.13 60.96,24.13 57.15,27.94 LPC1.19
P1.31
  Top 0.61: R20.2 81.92,19.05 74.93,26.04 60.33,26.04 59.69,26.67 LPC1.20
  Bottom 0.61: U5.8 U5.7 71.12,21.59 66.67,26.04 61.59,26.04 59.69,27.94 LPC1.20
SCL1
  Bottom 0.61: X7.3 76.83,55.24 77.47,54.61 79.38,54.61 80.64,53.34 80.64,50.16 66.04,50.16 64.14,47.62 64.14,31.75 64.77,31.11 72.39,31.11 LPC1.56
SCL2  (via drill 0.6)
  Top 0.61: v8.26,57.15 41.27,57.15 43.18,55.24 43.18,53.34 LPC1.41 44.45,50.8 46.99,48.26 R1.2 | v8.26,68.58 X6.3
  Bottom 0.61: v8.26,57.15 v8.26,68.58
SDA1  (via drill 0.6)
  Top 0.61: v69.22,38.73 69.22,38.1 67.94,36.83 67.94,32.38 73.36,32.38 LPC1.57
  Bottom 0.61: X7.5 79.38,57.15 82.55,53.98 82.55,49.53 81.92,48.9 69.85,48.9 67.94,46.99 67.94,40.01 v69.22,38.73
SDA2  (via drill 0.6)
  Top 0.61: v10.79,55.24 40.64,55.24 41.91,53.98 LPC1.40 41.91,49.53 46.35,45.09 R2.2 | v10.79,68.58 X6.5
  Bottom 0.61: v10.79,55.24 v10.79,68.58
USB_DM
  Bottom 0.61: R3.2 X6.11
USB_DP
  Bottom 0.61: R4.2 27.94,58.42 20.95,65.41 X6.13
V_H  (via drill 0.6)
  Top 0.61: v31.75,62.87 4.45,62.87 v4.45,62.23
  Bottom 0.254: U2.10 39.78,10.57 40.01,10.79 | U4.10 54.38,10.57 54.61,10.79 | U1.10 20.09,10.57 20.32,10.79 | U5.10 74.07,10.57 74.3,10.79
  Bottom 0.61: U3.10 45.72,65.41 43.18,62.87 v31.75,62.87 | v4.45,62.23 4.45,53.98 1.27,50.8 1.27,17.14 5.08,13.34
  Bottom 1.676: 5.08,13.34 21.59,13.34 | 21.59,13.34 41.27,13.34 | 41.27,13.34 55.88,13.34 | 55.88,13.34 75.56,13.34 | 75.56,13.34 77.42,13.34 X4.1 | 40.01,10.79 40.01,12.06 41.27,13.34 | 54.61,10.79 54.61,12.06 55.88,13.34 | 20.32,10.79 20.32,12.06 21.59,13.34 | 74.3,10.79 74.3,12.06 75.56,13.34
VCC
  Top 0.61: LPC1.2 13.97,31.11 14.61,31.75 29.21,31.75 31.49,34.03 IC1.3 40.92,35.2 C1.+ 41.35,34.92 48.26,34.92 52.38,39.05 C3.1 52.94,41.83 R2.1 R1.1 | X7.1 71.75,71.75 69.85,69.85 69.85,66.04 68.58,64.77 55.88,64.77 50.8,69.85 17.14,69.85 13.97,66.67 6.35,66.67 6.35,71.12 X6.1
  Bottom 0.61: X6.1 5.71,71.12 6.35,70.48 6.35,32.38 6.99,31.75 13.34,31.75 13.97,31.11 LPC1.2